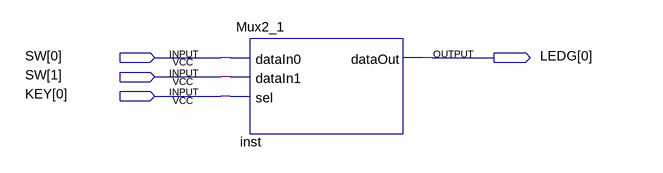
[diagram p0: schematic sheet]
// Quartus schematic Mux2_1Demo.bdf as structural Verilog: 1 symbols, 4 pins
module Mux2_1Demo (
  input  [1:0] SW,
  input  [0:0] KEY,
  output [0:0] LEDG
);

  Mux2_1 inst (.dataIn0(SW[0]), .dataIn1(SW[1]), .sel(KEY[0]), .dataOut(LEDG[0]));
endmodule
